# EAGLE design WayHugeAngryTroll (EAGLE 8.4.1)
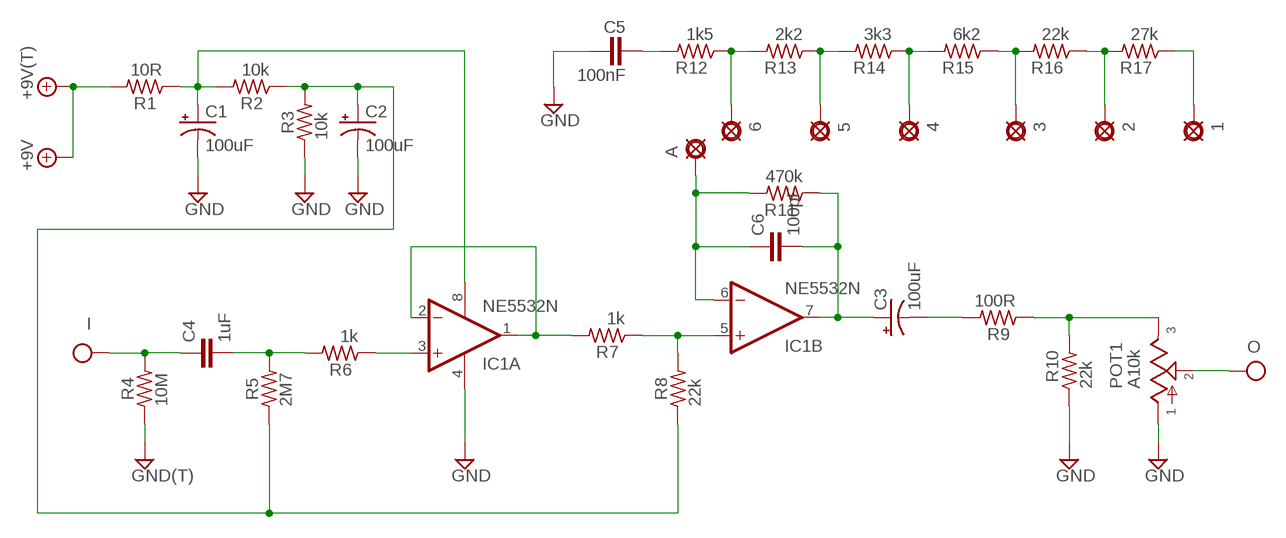
[diagram p0: schematic, sheet 1]

## Parts
1  PAD8  [OCTOGON]
2  PAD8  [OCTOGON]
3  PAD8  [OCTOGON]
4  PAD8  [OCTOGON]
5  PAD8  [OCTOGON]
6  PAD8  [OCTOGON]
+9  +9V(T)  [SQUARE]
A  PAD8  [OCTOGON]
C1  100uF  0631  [063_025]
C2  100uF  0631  [063_025]
C3  100uF  0631  [063_025]
C4  1uF  080X0502  [080X050]
C5  100nF  072X0352  [072X035]
C6  100pF  050X030_0251  [050X030_025]
G  GND(T)  [SQUARE]
I  IN(T)  [SQUARE]
IC1  NE5532N  [DIL08]
O  OUT(T)  [SQUARE]
POT1  A10k  POTR  [16MM-ROUND]
R1  10R  6MM.3  [R0207/3]
R2  10k  6MM.3  [R0207/3]
R3  10k  6MM.3  [R0207/3]
R4  10M  6MM.3  [R0207/3]
R5  2M7  6MM.3  [R0207/3]
R6  1k  6MM.3  [R0207/3]
R7  1k  6MM.3  [R0207/3]
R8  22k  6MM.3  [R0207/3]
R9  100R  6MM.3  [R0207/3]
R10  22k  6MM.3  [R0207/3]
R11  470k  6MM.3  [R0207/3]
R12  1k5  6MM.3  [R0207/3]
R13  2k2  6MM.3  [R0207/3]
R14  3k3  6MM.3  [R0207/3]
R15  6k2  6MM.3  [R0207/3]
R16  22k  6MM.3  [R0207/3]
R17  27k  6MM.3  [R0207/3]

## Nets
+9V: +9.1(+9V) R1.2
GND: C1.- C2.- C5.1 G.1(GND) IC1.4(P:V-) POT1.1 R3.1 R4.1 R10.1
IN: C4.1 I.1(IN) R4.2
N$1: C1.+ IC1.8(P:V+) R1.1 R2.2
N$2: C2.+ R2.1 R3.2 R5.1 R8.1
N$3: C4.2 R5.2 R6.2
N$4: IC1.3(A:+IN) R6.1
N$5: IC1.1(A:OUT) IC1.2(A:-IN) R7.2
N$6: C5.2 R12.2
N$7: IC1.5(B:+IN) R7.1 R8.2
N$8: 6.1(PAD) R12.1 R13.2
N$9: POT1.3 R9.1 R10.2
N$10: 5.1(PAD) R13.1 R14.2
N$11: C3.+ C6.2 IC1.7(B:OUT) R11.1
N$12: C3.- R9.2
N$13: A.1(PAD) C6.1 IC1.6(B:-IN) R11.2
N$14: 4.1(PAD) R14.1 R15.2
N$15: 3.1(PAD) R15.1 R16.2
N$16: 2.1(PAD) R16.1 R17.2
N$17: 1.1(PAD) R17.1
OUT: O.1(OUT) POT1.2

## Library data of the parts
1-6 A = mb_supply:PAD: PAD use this package for pads with any purpose, including input, output, send or return various pad shapes: round, square, octogonal, long, and long offset
+9 = mb_supply:+9V(T): +9V Voltage Supply use this to hook up +9v throughout a schematic instead of running wire automatically labels the net "+9v" adds a hookup pad to the circuit board
C1-C3 = mb_caps-electro:063: 33 - 220uF Xicon values at Mouser.com 10V: 220uF; 16V: 100uF; 25V: 100uF; 50V: 33uF
C4 = mb_caps-chicklet:080X050: 0.1uF Panasonic ECQ-B 8mm x 5mm
C5 = mb_caps-box:072X035: 0.15 - 1.0uF; WIMA MKP2 63, 100V: 0.047uF; MKS2 50V: 0.68 - 1.0uF; 63V: 0.33 - 0.47uF; 100V: 0.15 - 0.22uF;
C6 = mb_caps-ceramic:050X030_025: 47 - 120pF Xicon Ceramic Disc 2.5mm lead spacing
G = mb_supply:GND(T): Ground use this to hook up ground (GND) throughout a schematic instead of running wire automatically labels the net "GND" adds a hookup pad to the circuit board (you can use several)
I = mb_supply:IN(T): Input obsolete: use Pad instead and label net shematic input label with circuit board terminal/pad generally used only once on a schematic (because this device labels the net "IN" in the same way as a voltage supply or ground net)
IC1 = mb_ics:NE5532: AUDIO AMPLIFIER
O = mb_supply:OUT(T): Output obsolete: use Pad instead and label net output label with circuit board terminal/pad usually appears only once on a schematic
POT1 = mb_pots:POT: Potentiometers the arrow indicates the clockwise motion of th wiper (lug 2) fully counter clockwise there is no resistance between lugs 1 and 2 fully clockwise the resistance between lugs 1 and 2 is the value of the pot
R1-R17 = mb_resistors:6MM: 6mm Resistors Leads spaced 1-6 holes apart for 0.1" perfboard. Suitable for 1/4 watt resistors.

## Board
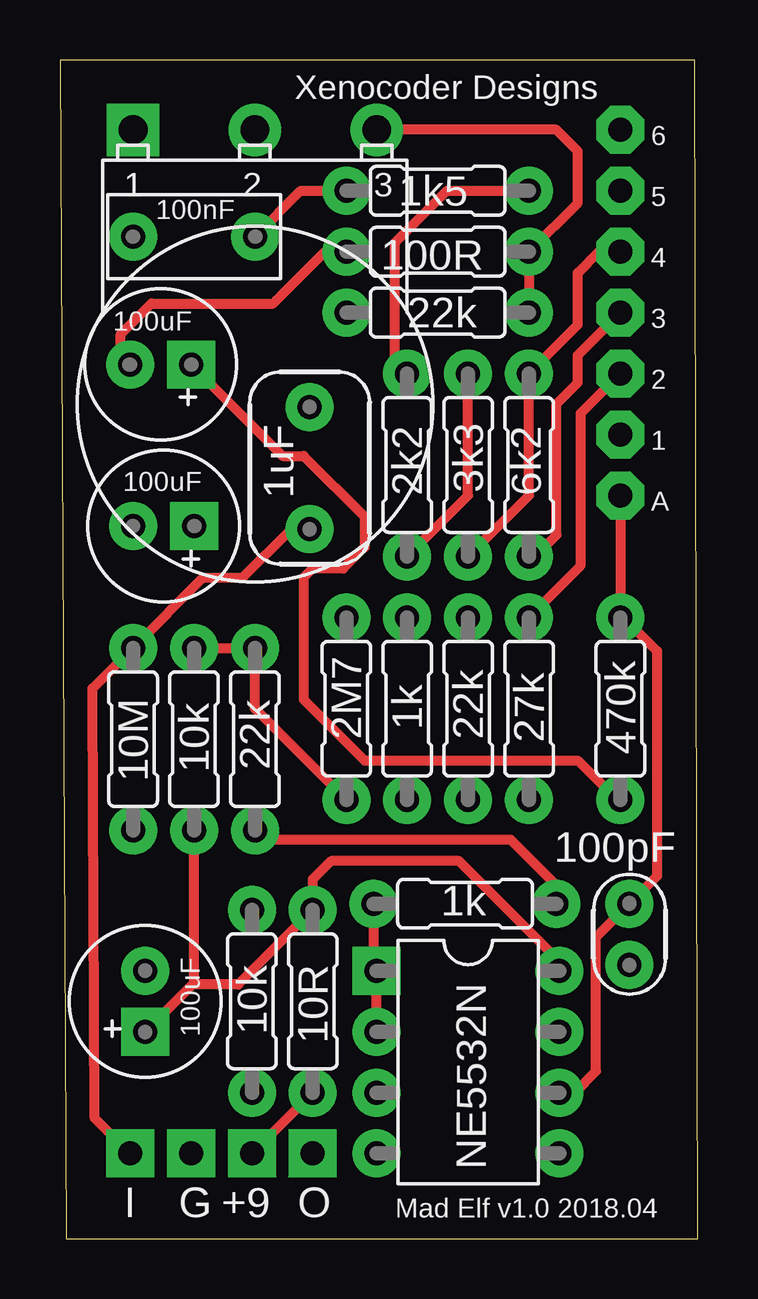
[diagram p1: board, top side]
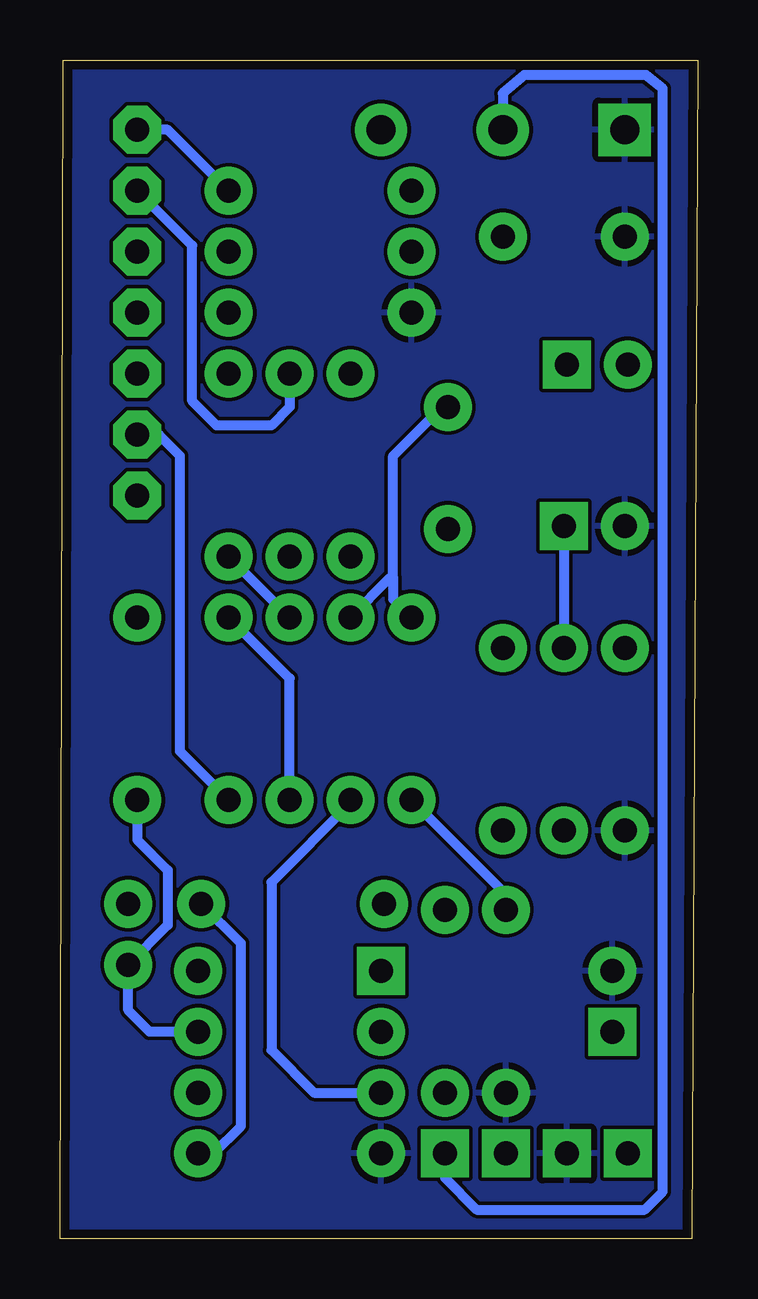
[diagram p2: board, bottom side, seen from below]

Size 26.59 x 49.14 mm. Coordinates in mm from the lower left corner, seen from the top.
Outline: 0.25,0 26.59,0 26.47,49.14 0,49.14 0.25,0
Copper layers (1*16): Top 0.035559375mm / dielectric 1.6mm / Bottom 0.035559375mm
Design rules "oshpark-2layer": minimum track width 6mil, minimum drill 10mil, track to track 6mil, track to pad 6mil, pad to pad 6mil, via to via 6mil, smd to smd 6mil, copper to edge 15mil, drill to drill 6mil, minimum pad ring 5mil, minimum via ring 5mil, stop-mask expansion 2.5mil, vias tented up to drill 0mil, thermal gap 10mil

### Footprints (pad centres in the part's own frame; a part is rotated, then mirrored left to right if it is on the bottom)
OCTOGON = drill 1 pad 2 octagon: 1 0,0
SQUARE = drill 1 pad 2 square: 1 0,0
063_025 = drill 1 pad 2 square: + -1.27,0 | drill 1 pad 2: - 1.27,0
080X050 = drill 1 pad 2: 1 -2.54,0; 2 2.54,0
072X035 = drill 1 pad 2: 1 -2.54,0; 2 2.54,0
050X030_025 = drill 1 pad 2: 1 -1.27,0; 2 1.27,0
DIL08 = drill 1 pad 2 square: 1 -3.81,-3.81 | drill 1 pad 2: 2 -1.27,-3.81; 3 1.27,-3.81; 4 3.81,-3.81; 5 3.81,3.81; 6 1.27,3.81; 7 -1.27,3.81; 8 -3.81,3.81
16MM-ROUND = drill 1.2 pad 2.184 square: 1 5.08,0 | drill 1.2 pad 2.184: 2 0,0; 3 -5.08,0
R0207/3 = drill 1 pad 2: 1 -3.81,0; 2 3.81,0

### Placement (x,y rotation side)
1  23.37,33.53 0 top
2  23.37,36.07 0 top
3  23.37,38.61 0 top
4  23.37,41.15 0 top
5  23.37,43.69 0 top
6  23.37,46.23 0 top
+9  8,3.56 0 top
A  23.37,30.99 0 top
C1  3.56,9.91 90 top
C2  4.32,29.72 180 top
C3  4.19,36.45 180 top
C4  10.41,32.13 90 top
C5  5.59,41.78 0 top
C6  23.75,12.7 270 top
G  5.46,3.56 0 top
I  2.92,3.56 0 top
IC1  17.02,7.37 270 top
O  10.54,3.56 0 top
POT1  8.13,46.23 180 top
R1  10.54,9.91 270 top
R2  5.59,20.83 270 top
R3  8,9.91 90 top
R4  3.05,20.83 90 top
R5  11.94,22.1 90 top
R6  14.48,22.1 90 top
R7  16.89,13.97 180 top
R8  8.13,20.83 270 top
R9  15.75,41.15 180 top
R10  15.75,38.61 0 top
R11  23.37,22.1 90 top
R12  15.75,43.69 180 top
R13  14.48,32.26 90 top
R14  17.02,32.26 90 top
R15  19.56,32.26 90 top
R16  17.02,22.1 90 top
R17  19.56,22.1 90 top

### Tracks (layer width: path | path; a pad name or v marks a point on that pad's centre or on a via)
+9V
  Top 0.406: +9.1 R1.2
GND
  pour Bottom: 0,49.15 0,-0.38 26.67,-0.38 26.67,49.15
IN
  Top 0.406: I.1 1.45,5.02 1.36,22.48 1.36,22.95 R4.2 5.97,27.56 7.62,27.56 9.65,29.59 C4.1
N$1
  Top 0.406: 5.52,10.61 C1.+ | 5.52,10.61 5.59,10.67 R2.2 | 5.52,10.61 7.43,10.61 R1.1 10.54,14.99 11.3,15.75 16.64,15.75 20.83,11.56 IC1.8
N$2
  Top 0.406: R2.1 R8.1 8.13,22.1 R5.1
  Bottom 0.406: C2.+ R2.1 | R3.2 8,14.35 R5.1
N$3
  Bottom 0.406: R5.2 12.7,26.67 12.7,27.56 | 12.7,27.56 12.7,32.64 10.67,34.67 C4.2 | R6.2 12.83,27.56 12.7,27.56
N$4
  Bottom 0.406: R6.1 14.48,18.16 17.78,14.86 17.78,7.87 16,6.1 IC1.3
N$5
  Top 0.406: R7.2 13.08,11.3 IC1.1 IC1.2
N$6
  Top 0.406: C5.2 10.03,43.69 R12.2
N$7
  Top 0.406: R7.1 20.7,14.73 18.8,16.64 8.51,16.64 R8.2
  Bottom 0.406: IC1.5 20.19,3.56 19.05,4.7 19.05,12.32 R7.1
N$8
  Top 0.406: R13.2 13.97,36.58 13.97,41.53 16.13,43.69 R12.1
  Bottom 0.406: R12.1 22.1,46.23 6.1
N$9
  Top 0.406: POT1.3 20.7,46.23 21.59,45.34 21.59,43.18 R9.1 R10.2
N$10
  Top 0.406: R13.1 17.02,30.99 R14.2
  Bottom 0.406: R14.2 17.02,34.67 17.78,33.91 20.07,33.91 21.08,34.92 21.08,41.4 5.1
N$11
  Top 0.406: C3.+ 9.27,32.64 10.16,32.64 12.7,30.1 12.7,28.83 11.81,27.94 10.54,27.94 10.16,27.56 10.16,22.48 12.7,19.94 21.59,19.94 23.24,18.29 R11.1
  Bottom 0.406: R11.1 23.37,16.64 22.1,15.37 22.1,13.08 C6.2 23.75,9.53 22.86,8.64 IC1.7
N$12
  Top 0.406: C3.- 2.54,36.83 2.54,37.72 3.81,38.99 8.89,38.99 11.05,41.15 R9.2
N$13
  Top 0.406: A.1 R11.2 23.5,25.91 24.89,24.51 24.89,15.11 C6.1 22.35,12.57 22.35,6.98 21.46,6.1 IC1.6
N$14
  Top 0.406: 4.1 22.48,41.15 21.59,40.26 21.59,38.1 R15.2 19.56,30.99 R14.1
N$15
  Top 0.406: R15.1 19.81,28.45 20.7,29.34 20.7,34.8 21.59,35.69 21.59,36.83 3.1
  Bottom 0.406: R16.2 R15.1
N$16
  Top 0.406: R17.2 21.72,28.07 21.72,34.42 2.1
  Bottom 0.406: R16.1 17.02,23.37 R17.2
N$17
  Bottom 0.406: R17.1 21.59,20.32 21.59,32.64 22.48,33.53 1.1
OUT
  Bottom 0.406: O.1 10.54,2.54 9.22,1.22 2.21,1.22 1.46,1.97 1.46,47.95 2.16,48.51 7.24,48.51 8.13,47.75 POT1.2

### Text on the board
tNames: Xenocoder Designs | Mad Elf v1.0 2018.04